# EAGLE design Real time Clock Circuit (EAGLE 9.6.2)
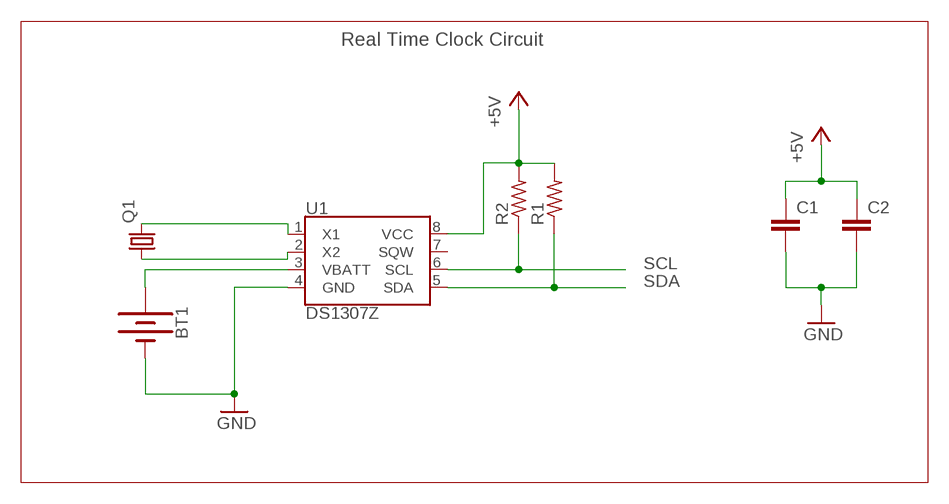
[diagram p0: schematic, sheet 1]

## Parts
BT1  BATTERY-20MM_PTH  [BATTCOM_20MM_PTH]
C1  C-EUC0805  [C0805]
C2  C-EUC0805  [C0805]
Q1  CRYSTALMM39SL  [MM39SL]
R1  R-US_R0805  [R0805]
R2  R-US_R0805  [R0805]
U1  DS1307Z  [SO08-0.15]

## Nets
+5V: C1.1 C2.1 R1.2 R2.2 U1.8(VCC)
GND: BT1.2(-) C1.2 C2.2 U1.4(GND)
N$1: Q1.4 U1.1(X1)
N$2: Q1.1 U1.2(X2)
N$3: BT1.1(+) U1.3(VBATT)
SCL: R2.1 U1.6(SCL)
SDA: R1.1 U1.5(SDA)
Unconnected: U1.7(SQW)

## Notes on the sheet
- Real Time Clock Circuit

## Library data of the parts
BT1 = SparkFun-Batteries:BATTERY: Battery - Single Cell A variety of battery chemistries, sizes, and footprints. Device List: 20MM_PTH - Coin Cell Battery Holder - 20mm (PTH) <https://www.sparkfun.com/products/783> 20MM_PTH_KIT- Coin Cell battery Holder - 20 mm (PTH) <http://www.sparkfun.com/products/783>kit version with special mask 6.8MM_PTH - Coin Cell Battery Holder - 6.8MM(SMD) <https://www.digikey.com/product-detail/en/seiko-instruments/MS621FE-FL11E/728-1057-ND/1889208?WT.srch=1&gclid=CNOQ5a6LzdQCFZS2wAodXCkE0g> 12MM_SMD - Coin Cell Battery Holder - 12mm (SMD) <https://www.sparkfun.com/products/10592> 12MM_PTH - Coin Cell Battery Holder - 12mm (PTH) <https://www.sparkfun.com/products/7948> 20MM_SMD - 20mm Coin Cell Battery Holder (SMD) (2 legs) Used on the Big Time Watch Kit <https://www.sparkfun.com/products/11734> 20MM_SMD_4LEGS - Coin Cell Battery Holder - 20mm (SMD) <https://www.sparkfun.com/products/11892> 20MM_SMD_4LEGS_OVERPASTE - Coin Cell Battery Holder - 20mm (SMD) <https://www.sparkfun.com/products/11892> (Over-paste on the legs) 24.5MM_PTH - Coin Cell Battery Holder - 24.5mm (PTH) <https://www.sparkfun.com/products/8863> 9V - 9V Battery Holder - PC Mount Used on the SparkFun SparkPunk Sound Kit <https://www.sparkfun.com/products/11177> and SparkFun SparkPunk Sequencer Kit <https://www.sparkfun.com/products/12707> 18650 - Battery Holder - 18650 (PTH) <https://www.sparkfun.com/products/13113> AA - Battery Holder - 1xAA (PTH) <https://www.sparkfun.com/products/7949> AAA - Battery Holder - 1xAAA (PTH) <https://www.sparkfun.com/products/12718> AA_KIT - Battery Holder - 1xAA (PTH) <https://www.sparkfun.com/products/7949> Special kit package - pads only have exposed copper on one side of the board. AAA_KIT - Battery Holder - 1xAAA (PTH) <https://www.sparkfun.com/products/12718> Special kit package - pads only have exposed copper on one side of the board.; PROD_ID: BATT-09031; SF_SKU: PRT-00783
C1 C2 = rcl:C-EU: CAPACITOR, European symbol; SPICEPREFIX: C
Q1 = adafruit:CRYSTAL: CRYSTAL; OC_FARNELL: unknown; OC_NEWARK: unknown
R1 R2 = rcl:R-US_: RESISTOR, American symbol; SPICEPREFIX: R
U1 = SparkFun-Clocks:DS1307: Maxim DS1307 - I2C Real-time clock (RTC) The DS1307 serial real-time clock (RTC) is a low-power, full binary-coded decimal (BCD) clock/calendar plus 56 bytes of NV SRAM. Address and data are transferred serially through an I2C, bidirectional bus. The clock/calendar provides seconds, minutes, hours, day, date, month, and year information. SparkFun Products: Real Time Clock Module <https://www.sparkfun.com/products/12708> (BOB-12708) Datasheet <https://cdn.sparkfun.com/datasheets/BreakoutBoards/DS1307.pdf>; PROD_ID: IC-08138

## Board
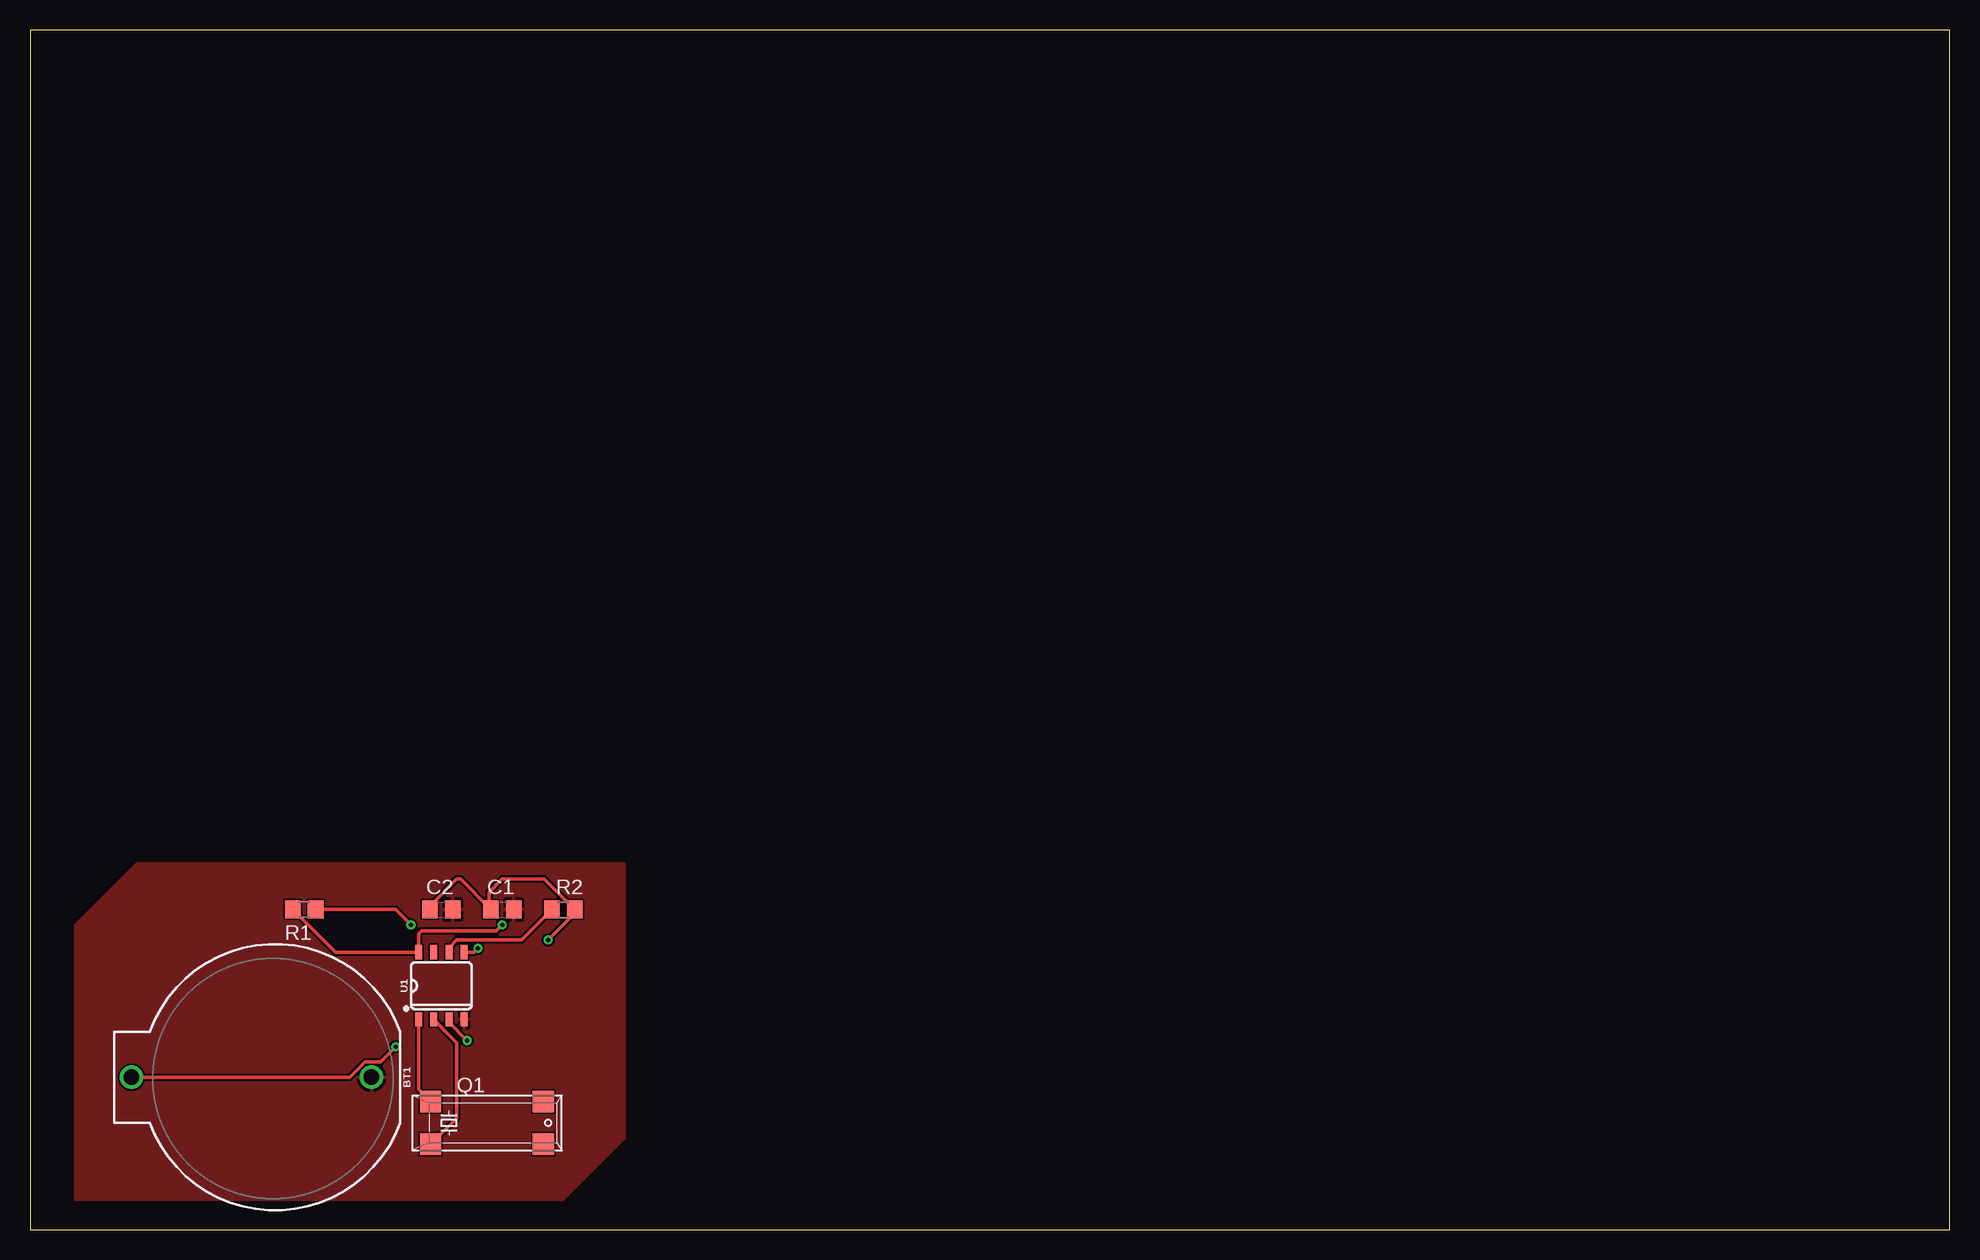
[diagram p1: board, top side]
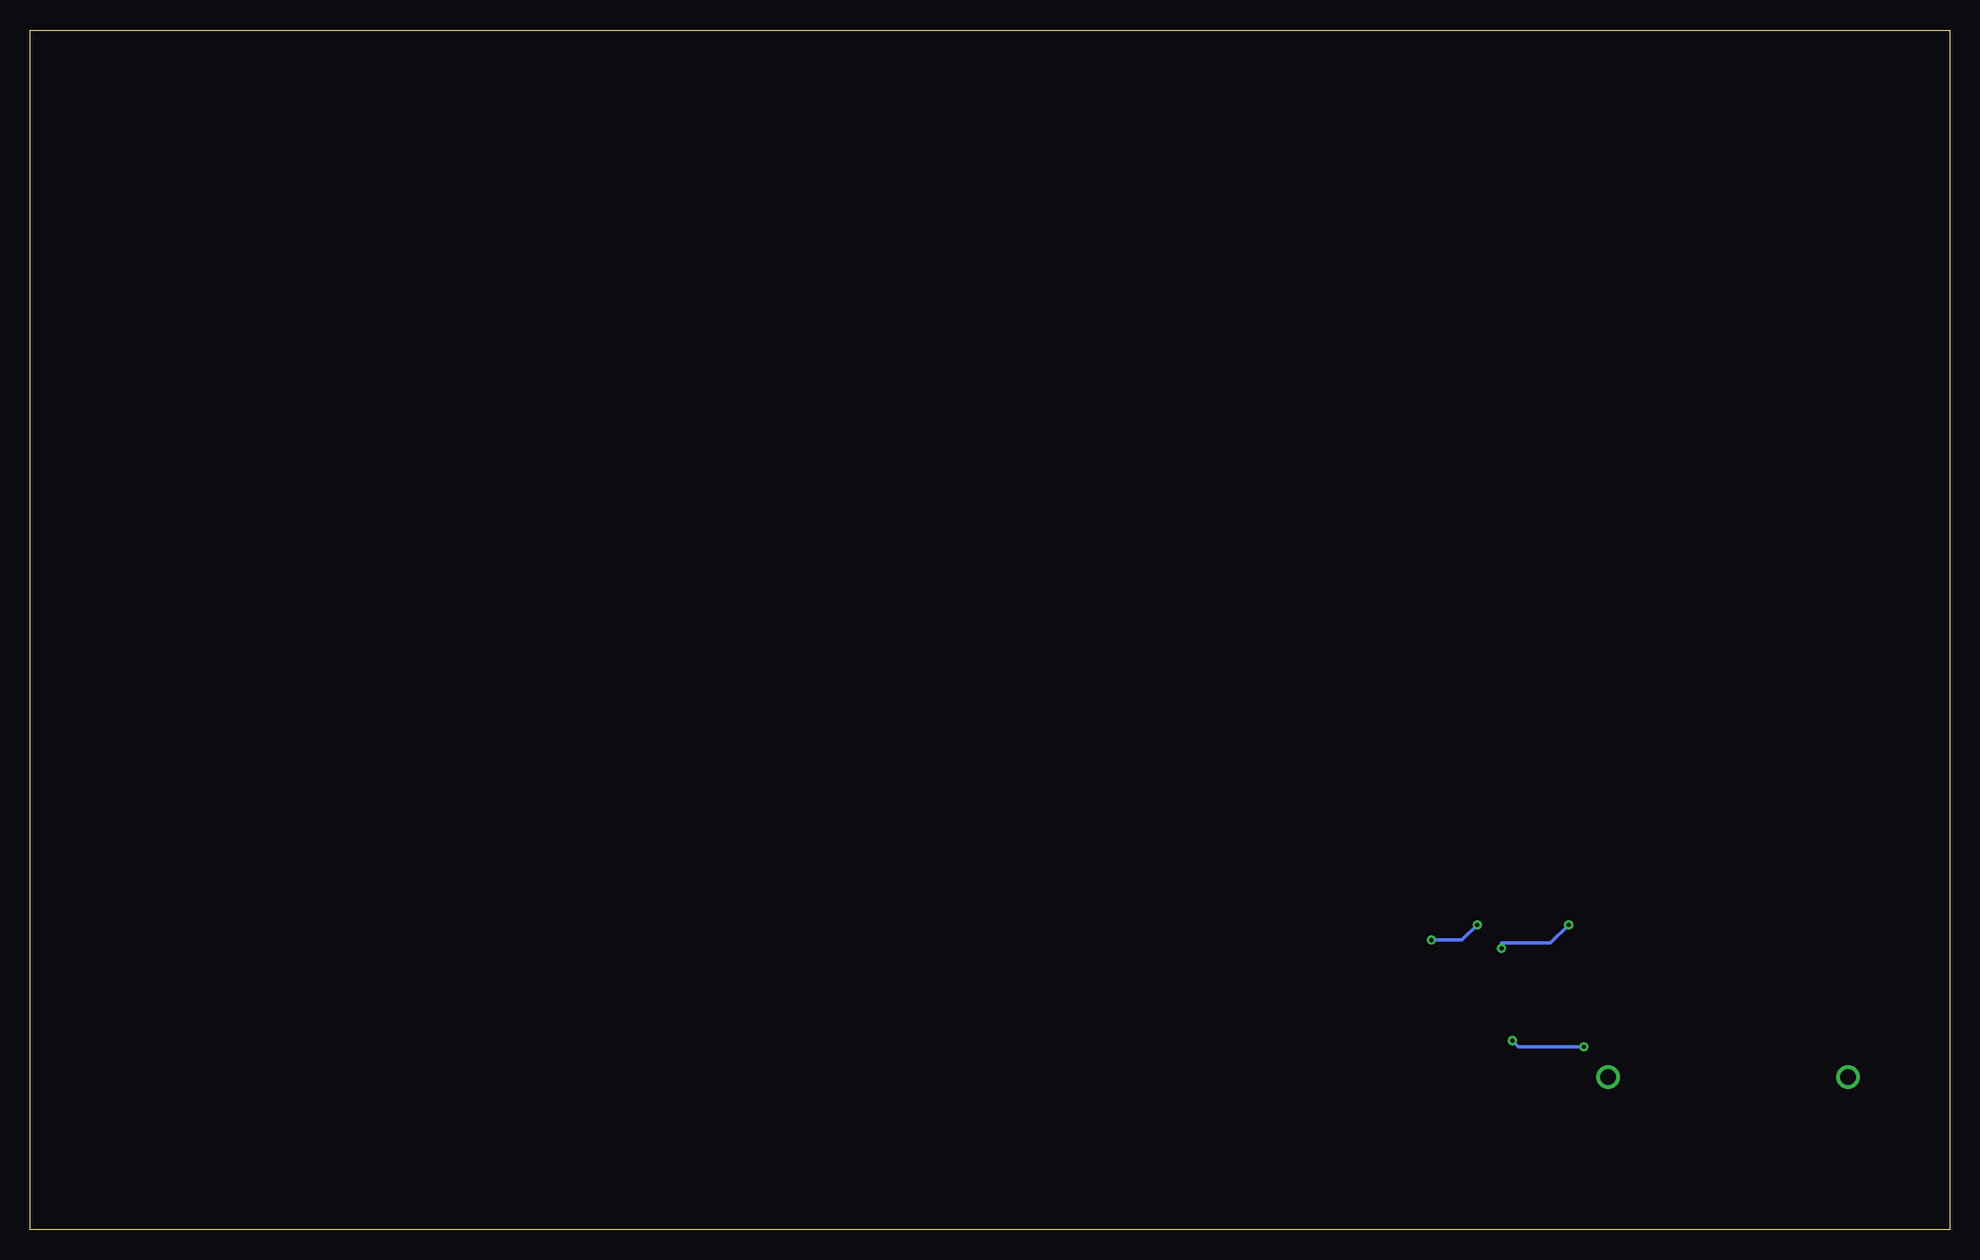
[diagram p2: board, bottom side, seen from below]

Size 160 x 100 mm. Coordinates in mm from the lower left corner, seen from the top.
Outline: 0,0 160,0 160,100 0,100 0,0
Copper layers (1*16): Top 0.035mm / dielectric 1.5mm / Bottom 0.035mm
Design rules "default": minimum track width 6mil, minimum drill 0.35mm, track to track 6mil, track to pad 6mil, pad to pad 6mil, via to via 6mil, smd to smd 6mil, copper to edge 40mil, drill to drill 6mil, minimum pad ring 10mil, minimum via ring 8mil, stop-mask expansion 4mil, vias tented up to drill 0mil, thermal gap 10mil

### Footprints (pad centres in the part's own frame; a part is rotated, then mirrored left to right if it is on the bottom)
BATTCOM_20MM_PTH = drill 1.3: 1 11.85,0; 2 -8.15,0
C0805 = smd 1.3 x 1.5: 1 -0.95,0; 2 0.95,0
MM39SL = smd 1.778 x 1.778: 1 -4.699,-1.778; 2 4.699,-1.778; 3 4.699,1.778; 4 -4.699,1.778
R0805 = smd 1.3 x 1.5: 1 -0.95,0; 2 0.95,0
SO08-0.15 = smd 0.6 x 1.2: 1 -1.905,-2.8; 2 -0.635,-2.8; 3 0.635,-2.8; 4 1.905,-2.8; 5 1.905,2.8; 6 0.635,2.8; 7 -0.635,2.8; 8 -1.905,2.8

### Placement (x,y rotation side)
BT1  20.32,12.7 180 top
C1  39.37,26.67 0 top
C2  34.29,26.67 0 top
Q1  38.1,8.89 0 top
R1  22.86,26.67 180 top
R2  44.45,26.67 0 top
U1  34.29,20.32 0 top

### Tracks (layer width: path | path; a pad name or v marks a point on that pad's centre or on a via)
+5V  (via drill 0.35)
  Top 0.305: C1.1 38.26,26.83 | 38.26,26.83 35.88,29.21 35.56,29.21 33.34,26.99 C2.1 | 38.26,26.83 38.26,28.1 39.37,29.21 42.86,29.21 R2.2 45.4,26.35 v43.18,24.13 | v39.37,25.4 38.86,24.89 32.64,24.89 32.38,24.64 U1.8 25.46,23.12 R1.2
  Bottom 0.305: v43.18,24.13 40.64,24.13 v39.37,25.4
GND
  pour Top: 3.81,2.54 3.81,25.4 8.89,30.48 49.53,30.48 49.53,7.62 44.45,2.54
N$1
  Top 0.305: U1.1 32.38,11.68 Q1.4
N$2
  Top 0.305: Q1.1 35.56,9.27 35.56,15.55 34.32,16.79 34.32,16.86 U1.2
N$3  (via drill 0.35)
  Top 0.305: BT1.1 26.66,12.7 27.94,13.98 29.22,13.98 v30.48,15.24 | v36.45,15.75 34.92,17.27 U1.3
  Bottom 0.305: v30.48,15.24 35.94,15.24 v36.45,15.75
SCL
  Top 0.305: R2.1 40.96,24.13 35.56,24.13 34.92,23.5 U1.6
SDA  (via drill 0.35)
  Top 0.305: R1.1 30.48,26.67 v31.75,25.4 | v37.34,23.45 37.01,23.12 U1.5
  Bottom 0.305: v31.75,25.4 33.27,23.88 37.34,23.88 v37.34,23.45